# Altium schematic sheet BopIt_Sch.SchDoc
size A; SheetNumber: 1; SheetTotal: 1
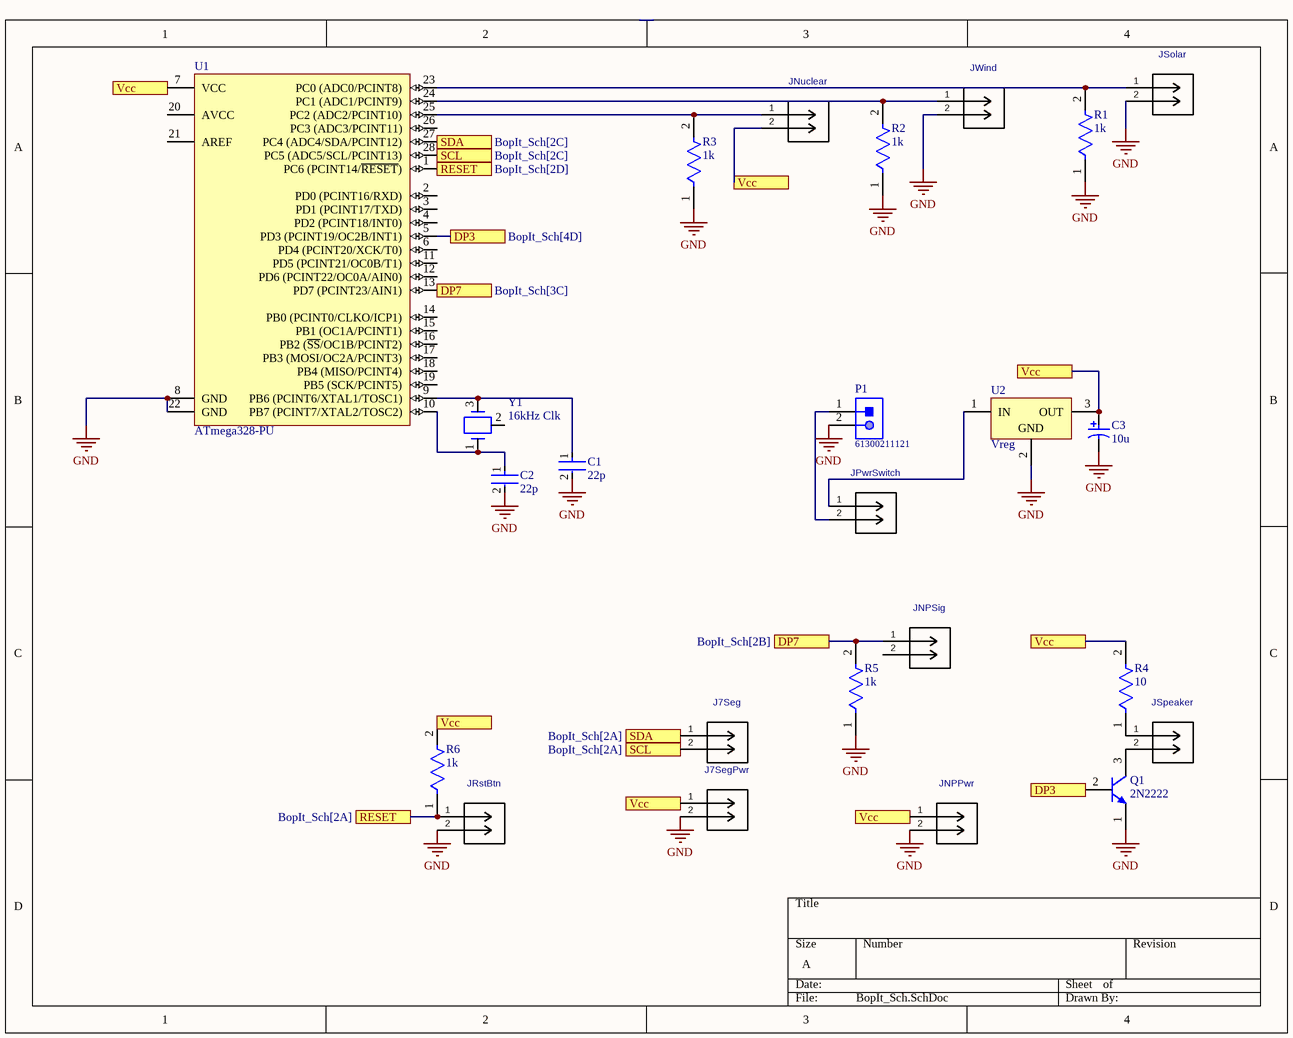
[diagram p0: BopIt_Sch.SchDoc]

## Parts
C1  22p  [FP-RCEWM1-MFG]
C2  22p  [FP-RCEWM1-MFG]
C3  10u  [NIC-UVR-10x12.5-2_V]
J7Seg  1729128  [CONN_1729128_PXC]  (value not drawn)
J7SegPwr  1729128  [CONN_1729128_PXC]  (value not drawn)
JNPPwr  1729128  [CONN_1729128_PXC]  (value not drawn)
JNPSig  1729128  [CONN_1729128_PXC]  (value not drawn)
JNuclear  1729128  [CONN_1729128_PXC]  (value not drawn)
JPwrSwitch  1729128  [CONN_1729128_PXC]  (value not drawn)
JRstBtn  1729128  [CONN_1729128_PXC]  (value not drawn)
JSolar  (no value)  [CONN_1729128_PXC]
JSpeaker  1729128  [CONN_1729128_PXC]  (value not drawn)
JWind  1729128  [CONN_1729128_PXC]  (value not drawn)
P1  61300211121  [61300211121]
Q1  2N2222  [MLTC-TO-18-3]
R1  1k  [FP-CF18-MFG]
R2  1k  [FP-CF18-MFG]
R3  1k  [FP-CF18-MFG]
R4  10  [FP-CF18-MFG]
R5  1k  [FP-CF18-MFG]
R6  1k  [FP-CF18-MFG]
U1  ATmega328-PU  [28P3]
U2  Vreg  [TO220]
Y1  16kHz Clk  [ECS-4X-3IL]

## Ports
DP3, DP3 (see BopIt_Sch[4D]), DP7 (see BopIt_Sch[2B]), DP7 (see BopIt_Sch[3C]), RESET (see BopIt_Sch[2A]), RESET (see BopIt_Sch[2D]), SCL (see BopIt_Sch[2A]), SCL (see BopIt_Sch[2C]), SDA (see BopIt_Sch[2A]), SDA (see BopIt_Sch[2C]), Vcc (see BopIt_Sch[1A], BopIt_Sch[2C], BopIt_Sch[2D], BopIt_Sch[3A], BopIt_Sch[3D], BopIt_Sch[4B]), Vcc (see BopIt_Sch[1A], BopIt_Sch[2C], BopIt_Sch[2D], BopIt_Sch[3A], BopIt_Sch[3D], BopIt_Sch[4C]), Vcc (see BopIt_Sch[1A], BopIt_Sch[2C], BopIt_Sch[2D], BopIt_Sch[3A], BopIt_Sch[4B], BopIt_Sch[4C]), Vcc (see BopIt_Sch[1A], BopIt_Sch[2C], BopIt_Sch[2D], BopIt_Sch[3D], BopIt_Sch[4B], BopIt_Sch[4C]), Vcc (see BopIt_Sch[1A], BopIt_Sch[2C], BopIt_Sch[3A], BopIt_Sch[3D], BopIt_Sch[4B], BopIt_Sch[4C]), Vcc (see BopIt_Sch[1A], BopIt_Sch[2D], BopIt_Sch[3A], BopIt_Sch[3D], BopIt_Sch[4B], BopIt_Sch[4C]), Vcc (see BopIt_Sch[2C], BopIt_Sch[2D], BopIt_Sch[3A], BopIt_Sch[3D], BopIt_Sch[4B], BopIt_Sch[4C])

## Nets
GND: C1.2 C2.2 C3.2 J7SegPwr.2 JNPPwr.2 JRstBtn.2 JSolar.2 JWind.2 P1.2 Q1.1(E) R1.1 R2.1 R3.1 R5.1 U1.8(GND) U1.22(GND) U2.2(GND)
DP3: Q1.2(B) U1.5(PD3_(PCINT19/OC2B/INT1)) ; port DP3
DP7: JNPSig.1 R5.2 U1.13(PD7_(PCINT23/AIN1)) ; port DP7
RESET: JRstBtn.1 R6.1 U1.1(PC6_(PCINT14/~{RESET})) ; port RESET
SCL: J7Seg.2 U1.28(PC5_(ADC5/SCL/PCINT13)) ; port SCL
SDA: J7Seg.1 U1.27(PC4_(ADC4/SDA/PCINT12)) ; port SDA
Vcc: C3.1 J7SegPwr.1 JNPPwr.1 JNuclear.2 R4.2 R6.2 U1.7(VCC) U2.3(OUT) ; port Vcc
NetC1_1: C1.1 U1.9(PB6_(PCINT6/XTAL1/TOSC1)) Y1.3
NetC2_1: C2.1 U1.10(PB7_(PCINT7/XTAL2/TOSC2)) Y1.1
NetJNuclear_1: JNuclear.1 R3.2 U1.25(PC2_(ADC2/PCINT10))
NetJPwrSwitch_1: JPwrSwitch.1 U2.1(IN)
NetJPwrSwitch_2: JPwrSwitch.2 P1.1
NetJSolar_1: JSolar.1 R1.2 U1.23(PC0_(ADC0/PCINT8))
NetJSpeaker_1: JSpeaker.1 R4.1
NetJSpeaker_2: JSpeaker.2 Q1.3(C)
NetJWind_1: JWind.1 R2.2 U1.24(PC1_(ADC1/PCINT9))

Not connected (* = marked no-connect by the designer): JNPSig 2; U1 2(PD0_(PCINT16/RXD)) 3(PD1_(PCINT17/TXD)) 4(PD2_(PCINT18/INT0)) 6(PD4_(PCINT20/XCK/T0)) 11(PD5_(PCINT21/OC0B/T1)) 12(PD6_(PCINT22/OC0A/AIN0)) 14(PB0_(PCINT0/CLKO/ICP1)) 15(PB1_(OC1A/PCINT1)) 16(PB2_(~{SS}/OC1B/PCINT2)) 17(PB3_(MOSI/OC2A/PCINT3)) 18(PB4_(MISO/PCINT4)) 19(PB5_(SCK/PCINT5)) 20(AVCC) 21(AREF) 26(PC3_(ADC3/PCINT11)); Y1 2

## Library data of the parts
C1 C2 = CMP-06035-054690-1: Cap Ceramic 10uF 50V X7R ±20% Radial 5mm +125°C Automotive Ammo Pack; Lead Diameter: 0.5mm; Lead/Base Style: Formed Leads; Width: 0.157inch; Termination: Radial; Case/Package: Radial; Packaging: Tape and Reel; Ratings: AEC-Q200; Voltage: 50V; Dielectric: X7R; Package Quantity: 1500; Mount: Through Hole; Voltage Rating (DC): 50V; Height - Seated (Max): 0.295inch; Length: 5.5mm; Height: 7.5mm; Tolerance: 20%; Lead Pitch: 0.197inch; Min Operating Temperature: -55°C; Resistor Type: Ceramic; Max Operating Temperature: 125°C; Capacitance: 10uF; Depth: 7.5mm; Diameter: 5.5mm; Voltage Rating: 50V
C3 = CMP-1217-00001-1: Aluminum Electrolytic Capacitor, 63 V, -40 to 85 degC, 2-Pin CAP, RoHS; Manufacturer: Nichicon; PartNumber: UVR1J101MPD1TD; Capacitance Tolerance: +/-20%; Rated Voltage: 63 V; Packing: Bulk; Rated Ripple@85 degC 120 Hz: 300 mA; Rated Capacitance: 100 uF; ComponentLink3URL: http://nichicon-us.com/english/products/pdfs/e-vr.pdf; ComponentLink2Description: Datasheet; Operating Temperature: -40 to 85 degC; PackageDescription: 2-Pin Through Hole Package, Dia 10 mm, Body Length 12.5 mm, Pitch 5 mm; Mounting Technology: Through Hole; ComponentLink3Description: Package Specification; RoHS: TRUE; DatasheetVersion: Sep-13; ComponentLink1Description: Manufacturer URL; ComponentLink2URL: http://nichicon-us.com/english/products/pdfs/e-vr.pdf; ComponentLink1URL: http://www.nichicon.co.jp/
J7Seg J7SegPwr JNPPwr JNPSig JNuclear JPwrSwitch JRstBtn JSolar JSpeaker JWind = 1729128: Mfr_Name: Phoenix Contact; C: Copyright (C) 2018 Accelerated Designs. All rights reserved; Value: 1729128; Copyright: Copyright (C) 2022 Ultra Librarian. All rights reserved.; Manufacturer_Part_Number: 1729128; Digi-Key_Part_Number_1: 277-1247-ND
P1 = CMP-1712-00002-4: THT Vertical Pin Header WR-PHD, Pitch 2.54 mm, Single Row, 2 pins; Manufacturer: Wurth Elektronik; Rated Current: 3A; Gender: Male; Withstanding Voltage: 500VAC; Working Voltage: 250VAC; Pitch: 2.54mm; Contact Resistance: 20mOhm; Pin Number: 2; Mounting Technology: THT; Orientation: Vertical; Operating Temperature: -40to105degC; Packaging: Bag; Publisher: WurthElektronik; Datasheet URL: https://katalog.we-online.de/em/datasheet/6130xx11121.pdf; Manufacturer URL: http://www.we-online.de; Row Number: Single; Package Reference: 61300211121; Part Number: 61300211121
Q1 = CMP-2000-05237-1: Low Power Bipolar NPN Transistor, 30 V, -65 to 200 degC, 3-Pin TO-18, RoHS, Bulk; Manufacturer: Multicomp; Pin Configuration: a; No. of Pins: 3; No. of Transistors: 1; Collector Emitter Voltage Vces: 400mV; Current Ic Continuous a Max: 800mA; Power Dissipation Pd: 500mW; Collector Emitter Voltage V(br)ceo: 30V; Gain Bandwidth ft Typ: 250MHz; Voltage Vcbo: 60V; DC Current Gain hFE: 100; Full Power Rating Temperature: 25degC; Current Ic @ Vce Sat: 150mA; SVHC: NoSVHC(19-Dec-2012); Package Reference: TO-18-3; Package Description: 3-Pin Transistor Outline Package (TO-18), Dia 5.54 mm, Pitch Pitch 1.485mm; Datasheet URL: http://www.farnell.com/datasheets/1662272.pdf; Transistor Case Style: TO-18; Continuous Collector Current Ic Max: 800mA; Manufacturer URL: http://uk.farnell.com/b/multicomp; DC Collector Current: 800mA; Hfe Min: 100; Transistor Polarity: NPN; Power Dissipation Ptot Max: 500mW; Package / Case: TO-18; Datasheet Version: Rev. 1.1, 05/2012; Gain Bandwidth ft Min: 250MHz; Current Ic hFE: 150mA
R1-R6 = CMP-26528-000001-1: RES 2.2K OHM 1/8W 5% CF AXIAL; Manufacturer: Stackpole Electronics Inc; Manufacturer Part Number: CF18JT2K20; Description: RES 2.2K OHM 1/8W 5% AXIAL; Value: 2.2kΩ; Voltage Rating: 250V; Temperature Coefficient: 0/-400ppm/°C; Power Rating: 0.125W; Composition: Carbon Film; Octopart: https://octopart.com/cf18jt2k20-stackpole+electronics-19205714; Tolerance: 5%; Series: CF; Temperature Range Low: -55°C; ComponentLink2URL: https://www.seielect.com/catalog/sei-cf_cfm.pdf; Ipc Land Pattern Name: RESAD656W65L360D200; Package: CF18; Device Class L2: Resistors; Device Class L3: Through-Hole Resistors; Resistance: 2.2kΩ; Height: 2mm; Category: Res; ComponentLink2Description: Datasheet; Lead Free: Yes; Temperature Range High: +155°C; Temperature: -55°C to +155°C; RoHS: TRUE; Device Class L1: Passive Components; Digikey Description: RES 2.2K OHM 1/8W 5% CF AXIAL; Automotive: No
U1 = CMP-0095-00015-2: 8-bit AVR Microcontroller, 32KB Flash, 1KB EEPROM, 2KB SRAM, 28-pin PDIP, Industrial Grade (-40°C to 85°C); ComponentLink3Description: ATmega48A/48PA/88A/88PA/168A/168PA/328/328P Summary; RevisionNote: DatasheetVersion updated. URLs added.; DatasheetVersion: revD, May-2011; ComponentLink1URL: http://www.atmel.com/; PackageVersion: revB, Sep-2001; PackageDescription: 28-lead (0.300"/7.62mm Wide) Plastic Dual Inline Package (PDIP); PackageReference: 28P3; ComponentLink1Description: Manufacturer URL; ComponentLink2Description: ATmega48A/48PA/88A/88PA/168A/168PA/328/328P Datasheet; ComponentLink3URL: http://www.atmel.com/dyn/resources/prod_documents/8271S.pdf; ComponentLink2URL: http://www.atmel.com/dyn/resources/prod_documents/8271.pdf
U2 = CMP-0244-00483-1: Positive Voltage Regulator, 5V, 3-Pin TO-220; PackageDescription: TO, Thru-Hole, Vertical, Heatsink Mounted; 3 In-Line Leads; Pitch 2.54 mm; ComponentLink2Description: Datasheet; PackageReference: TO220; ComponentLink3URL: http://www.st.com/internet/com/TECHNICAL_RESOURCES/TECHNICAL_LITERATURE/PACKAGE_INFORMATION/CD00004649.pdf; DatasheetVersion: 16/11/2011; ComponentLink1Description: Manufacturer URL; ComponentLink1URL: http://www.st.com; PackageVersion: ver3.0; ComponentLink3Description: Package Specification; ComponentLink2URL: http://www.st.com/internet/com/TECHNICAL_RESOURCES/TECHNICAL_LITERATURE/DATASHEET/CD00000444.pdf
Y1 = CMP-1669-00001-2: CRYSTAL 20.000MHZ 20PF 49US; Manufacturer: ECS; PartNumber: ECS-200-20-4X; ComponentLink1URL: http://www.ecsxtal.com/store/pdf/hc-49usx.pdf; ComponentLink1Description: Datasheet; PackageReference: 4X-3IL